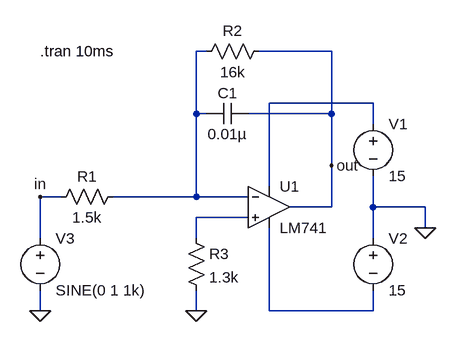
[diagram p0: schematic 10-int.asc]
10-int.asc, the LTspice schematic file:
Version 4.1
SHEET 1 880 680
WIRE 128 -80 112 -80
WIRE 320 -80 208 -80
WIRE 384 0 224 0
WIRE 112 16 112 -80
WIRE 128 16 112 16
WIRE 320 16 320 -80
WIRE 320 16 192 16
WIRE 384 32 384 0
WIRE 320 96 320 16
WIRE 224 128 224 0
WIRE -96 144 -128 144
WIRE 112 144 112 16
WIRE 112 144 -16 144
WIRE 192 144 112 144
WIRE 320 160 320 96
WIRE 320 160 256 160
WIRE 384 160 384 112
WIRE 464 160 384 160
WIRE 192 176 112 176
WIRE 464 192 464 160
WIRE -128 208 -128 144
WIRE 112 208 112 176
WIRE 384 208 384 160
WIRE -128 320 -128 288
WIRE 112 320 112 288
WIRE 224 320 224 192
WIRE 384 320 384 288
WIRE 384 320 224 320
FLAG 112 320 0
FLAG -128 320 0
FLAG -128 144 in
FLAG 320 96 out
FLAG 464 192 0
SYMBOL LM741 224 96 R0
SYMATTR InstName U1
SYMBOL voltage 384 16 R0
SYMATTR InstName V1
SYMATTR Value 15
SYMBOL voltage 384 192 R0
SYMATTR InstName V2
SYMATTR Value 15
SYMBOL res 0 128 R90
WINDOW 0 0 56 VBottom 2
WINDOW 3 32 56 VTop 2
SYMATTR InstName R1
SYMATTR Value 1.5k
SYMBOL res 224 -96 R90
WINDOW 0 0 56 VBottom 2
WINDOW 3 32 56 VTop 2
SYMATTR InstName R2
SYMATTR Value 16k
SYMBOL voltage -128 192 R0
WINDOW 123 24 124 Left 2
WINDOW 39 0 0 Left 0
SYMATTR InstName V3
SYMATTR Value SINE(0 1 1k)
SYMBOL res 96 192 R0
SYMATTR InstName R3
SYMATTR Value 1.3k
SYMBOL cap 192 0 R90
WINDOW 0 0 32 VBottom 2
WINDOW 3 32 32 VTop 2
SYMATTR InstName C1
SYMATTR Value 0.01µ
TEXT -128 -80 Left 2 !.tran 10ms

The netlist it stands for:
* 10-int.asc
X§U1 N003 N001 N002 N004 out LM741  ; pins In+ In- V+ V- OUT
V1 N002 0 15
V2 0 N004 15
R1 N001 in 1.5k
R2 out N001 16k
V3 in 0 SINE(0 1 1k)
R3 N003 0 1.3k
C1 out N001 0.01µ
.tran 10ms
.lib LM741.lib
.backanno
.end